# EAGLE design BigTimeTop (EAGLE 7.6.0)
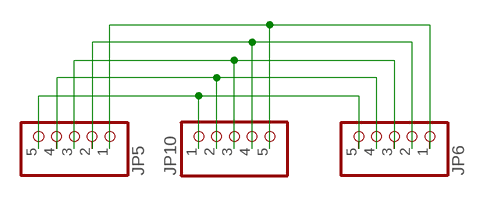
[diagram p0: schematic, sheet 1]

## Parts
JP5  HEADER-1X576MIL  [1X05_ROUND_76]
JP6  HEADER-1X576MIL  [1X05_ROUND_76]
JP10  HEADER-1X576MIL  [1X05_ROUND_76]

## Nets
N$11: JP5.5 JP6.5 JP10.1
N$14: JP5.4 JP6.4 JP10.2
N$15: JP5.3 JP6.3 JP10.3
N$16: JP5.2 JP6.2 JP10.4
N$17: JP5.1 JP6.1 JP10.5

## Library data of the parts
JP5 JP6 JP10 = microbuilder:HEADER-1X5: PIN HEADER

## Board
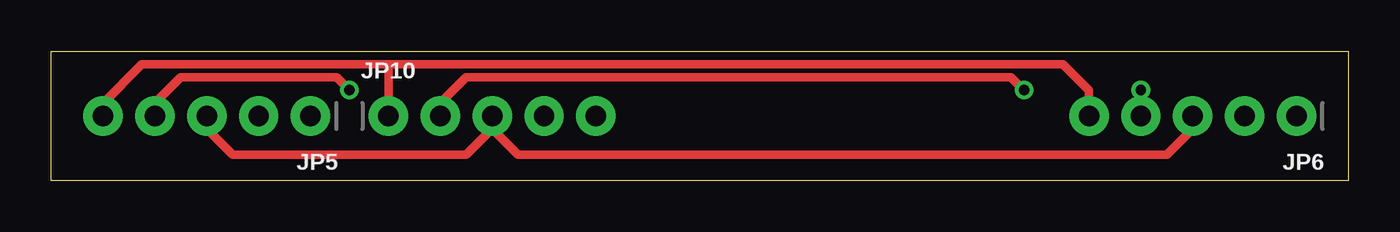
[diagram p1: board, top side]
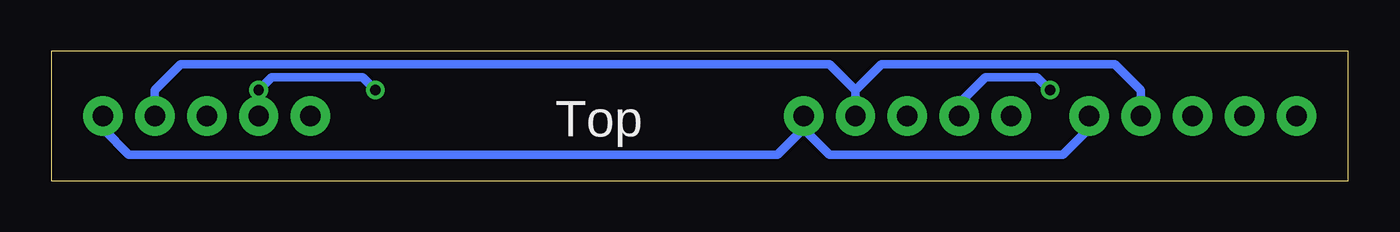
[diagram p2: board, bottom side, seen from below]

Size 63.5 x 6.35 mm. Coordinates in mm from the lower left corner, seen from the top.
Outline: 0,0 0,6.35 63.5,6.35 63.5,0 0,0
Copper layers (1*16): Top 0.035mm / dielectric 1.5mm / Bottom 0.035mm
Design rules "default *": minimum track width 8mil, minimum drill 15.5mil, track to track 8mil, track to pad 8mil, pad to pad 8mil, via to via 8mil, smd to smd 8mil, copper to edge 10mil, drill to drill 8mil, minimum pad ring 10mil, minimum via ring 8mil, stop-mask expansion 2mil, vias tented up to drill 20mil, thermal gap 10mil

### Footprints (pad centres in the part's own frame; a part is rotated, then mirrored left to right if it is on the bottom)
1X05_ROUND_76 = drill 1 pad 1.93: 1 -5.08,0; 2 -2.54,0; 3 0,0; 4 2.54,0; 5 5.08,0

### Placement (x,y rotation side)
JP5  7.62,3.17 180 top
JP6  55.88,3.17 180 top
JP10  21.59,3.17 0 top

### Tracks (layer width: path | path; a pad name or v marks a point on that pad's centre or on a via)
N$11
  Top 0.406: JP5.5 2.54,3.81 4.45,5.71 16.51,5.71 | JP10.1 16.51,5.71 | 16.51,5.71 49.53,5.71 50.8,4.44 JP6.5
N$14  (via drill 0.5)
  Top 0.406: JP6.4 v53.34,4.44 | JP10.2 19.05,3.81 20.32,5.08 46.99,5.08 v47.62,4.44 | JP5.4 5.08,3.81 6.35,5.08 13.97,5.08 v14.61,4.44
  Bottom 0.406: v53.34,4.44 52.7,5.08 48.26,5.08 v47.62,4.44 | v14.61,4.44 15.24,5.08 17.78,5.08 19.05,3.81 JP10.2
N$15
  Top 0.406: JP6.3 55.88,2.54 54.61,1.27 22.86,1.27 21.59,2.54 | JP10.3 21.59,2.54 | 21.59,2.54 20.32,1.27 8.89,1.27 7.62,2.54 JP5.3
N$16
  Bottom 0.406: JP5.2 10.16,4.44 11.43,5.71 22.86,5.71 24.13,4.44 | JP10.4 24.13,4.44 | 24.13,4.44 25.4,5.71 57.15,5.71 58.42,4.44 JP6.2
N$17
  Bottom 0.406: JP5.1 12.7,2.54 13.97,1.27 25.4,1.27 26.67,2.54 | JP10.5 26.67,2.54 | 26.67,2.54 27.94,1.27 59.69,1.27 60.96,2.54 JP6.1

### Text on the board
bPlace: Top